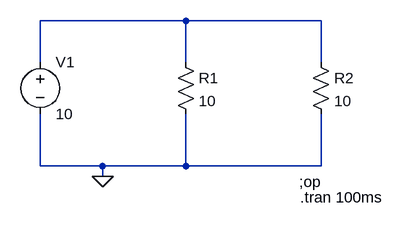
[diagram p0: schematic KCL_own_circuit.asc]
KCL_own_circuit.asc, the LTspice schematic file:
Version 4
SHEET 1 880 680
WIRE 176 32 -48 32
WIRE 384 32 176 32
WIRE -48 96 -48 32
WIRE 176 96 176 32
WIRE 384 96 384 32
WIRE -48 256 -48 176
WIRE 48 256 -48 256
WIRE 176 256 176 176
WIRE 176 256 48 256
WIRE 384 256 384 176
WIRE 384 256 176 256
WIRE 48 272 48 256
FLAG 48 272 0
SYMBOL voltage -48 80 R0
SYMATTR InstName V1
SYMATTR Value 10
SYMBOL res 160 80 R0
SYMATTR InstName R1
SYMATTR Value 10
SYMBOL res 368 80 R0
SYMATTR InstName R2
SYMATTR Value 10
TEXT 350 280 Left 2 !;op
TEXT 352 304 Left 2 !.tran 100ms

The netlist it stands for:
* KCL_own_circuit.asc
V1 N001 0 10
R1 N001 0 10
R2 N001 0 10
;op
.tran 100ms
.backanno
.end